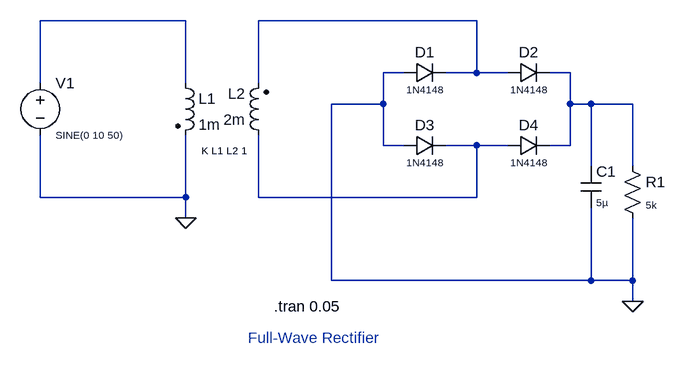
[diagram p0: schematic Full_Wave_Rectifier.asc]
Full_Wave_Rectifier.asc, the LTspice schematic file:
Version 4
SHEET 1 880 712
WIRE 0 208 -224 208
WIRE 448 208 112 208
WIRE 336 288 304 288
WIRE 448 288 448 208
WIRE 448 288 400 288
WIRE 496 288 448 288
WIRE 592 288 560 288
WIRE -224 304 -224 208
WIRE 0 304 0 208
WIRE 112 304 112 208
WIRE 304 336 304 288
WIRE 304 336 224 336
WIRE 592 336 592 288
WIRE 624 336 592 336
WIRE 688 336 624 336
WIRE 304 400 304 336
WIRE 336 400 304 400
WIRE 448 400 400 400
WIRE 496 400 448 400
WIRE 592 400 592 336
WIRE 592 400 560 400
WIRE 624 432 624 336
WIRE 688 432 688 336
WIRE -224 480 -224 384
WIRE 0 480 0 384
WIRE 0 480 -224 480
WIRE 112 480 112 384
WIRE 448 480 448 400
WIRE 448 480 112 480
WIRE 0 512 0 480
WIRE 224 608 224 336
WIRE 624 608 624 496
WIRE 624 608 224 608
WIRE 688 608 688 512
WIRE 688 608 624 608
WIRE 688 640 688 608
FLAG 688 640 0
FLAG 0 512 0
SYMBOL diode 336 304 R270
WINDOW 0 32 32 VTop 2
WINDOW 3 0 32 VBottom 1
SYMATTR InstName D1
SYMATTR Value 1N4148
SYMBOL diode 496 304 R270
WINDOW 0 32 32 VTop 2
WINDOW 3 0 32 VBottom 1
SYMATTR InstName D2
SYMATTR Value 1N4148
SYMBOL Res 672 416 R0
WINDOW 3 36 76 Left 1
SYMATTR InstName R1
SYMATTR Value 5k
SYMBOL ind2 -16 288 R0
SYMATTR InstName L1
SYMATTR Value 1m
SYMATTR Type ind
SYMBOL ind2 128 400 R180
WINDOW 0 36 80 Left 2
WINDOW 3 36 40 Left 2
SYMATTR InstName L2
SYMATTR Value 2m
SYMATTR Type ind
SYMBOL Voltage -224 288 R0
WINDOW 3 24 96 Left 1
SYMATTR Value SINE(0 10 50)
SYMATTR InstName V1
SYMATTR SpiceLine Rser=0.1m
SYMBOL diode 336 416 R270
WINDOW 0 32 32 VTop 2
WINDOW 3 0 32 VBottom 1
SYMATTR InstName D3
SYMATTR Value 1N4148
SYMBOL diode 496 416 R270
WINDOW 0 32 32 VTop 2
WINDOW 3 0 32 VBottom 1
SYMATTR InstName D4
SYMATTR Value 1N4148
SYMBOL Cap 608 432 R0
WINDOW 3 24 56 Left 1
SYMATTR InstName C1
SYMATTR Value 5µ
TEXT 24 408 Left 1 !K L1 L2 1
TEXT 136 648 Left 2 !.tran 0.05
TEXT 96 696 Left 2 ;Full-Wave Rectifier

The netlist it stands for:
* Full_Wave_Rectifier.asc
D1 0 N002 1N4148
D2 N002 N003 1N4148
R1 N003 0 5k
L1 N001 0 1m
L2 N004 N002 2m
V1 N001 0 SINE(0 10 50) Rser=0.1m
D3 0 N004 1N4148
D4 N004 N003 1N4148
C1 N003 0 5µ
.model D D
.lib standard.dio
K L1 L2 1
.tran 0.05
* Full-Wave Rectifier
.backanno
.end